# Altium project LimeSDR-QPCIe_1v2.PrjPcb (part 13 of 13)
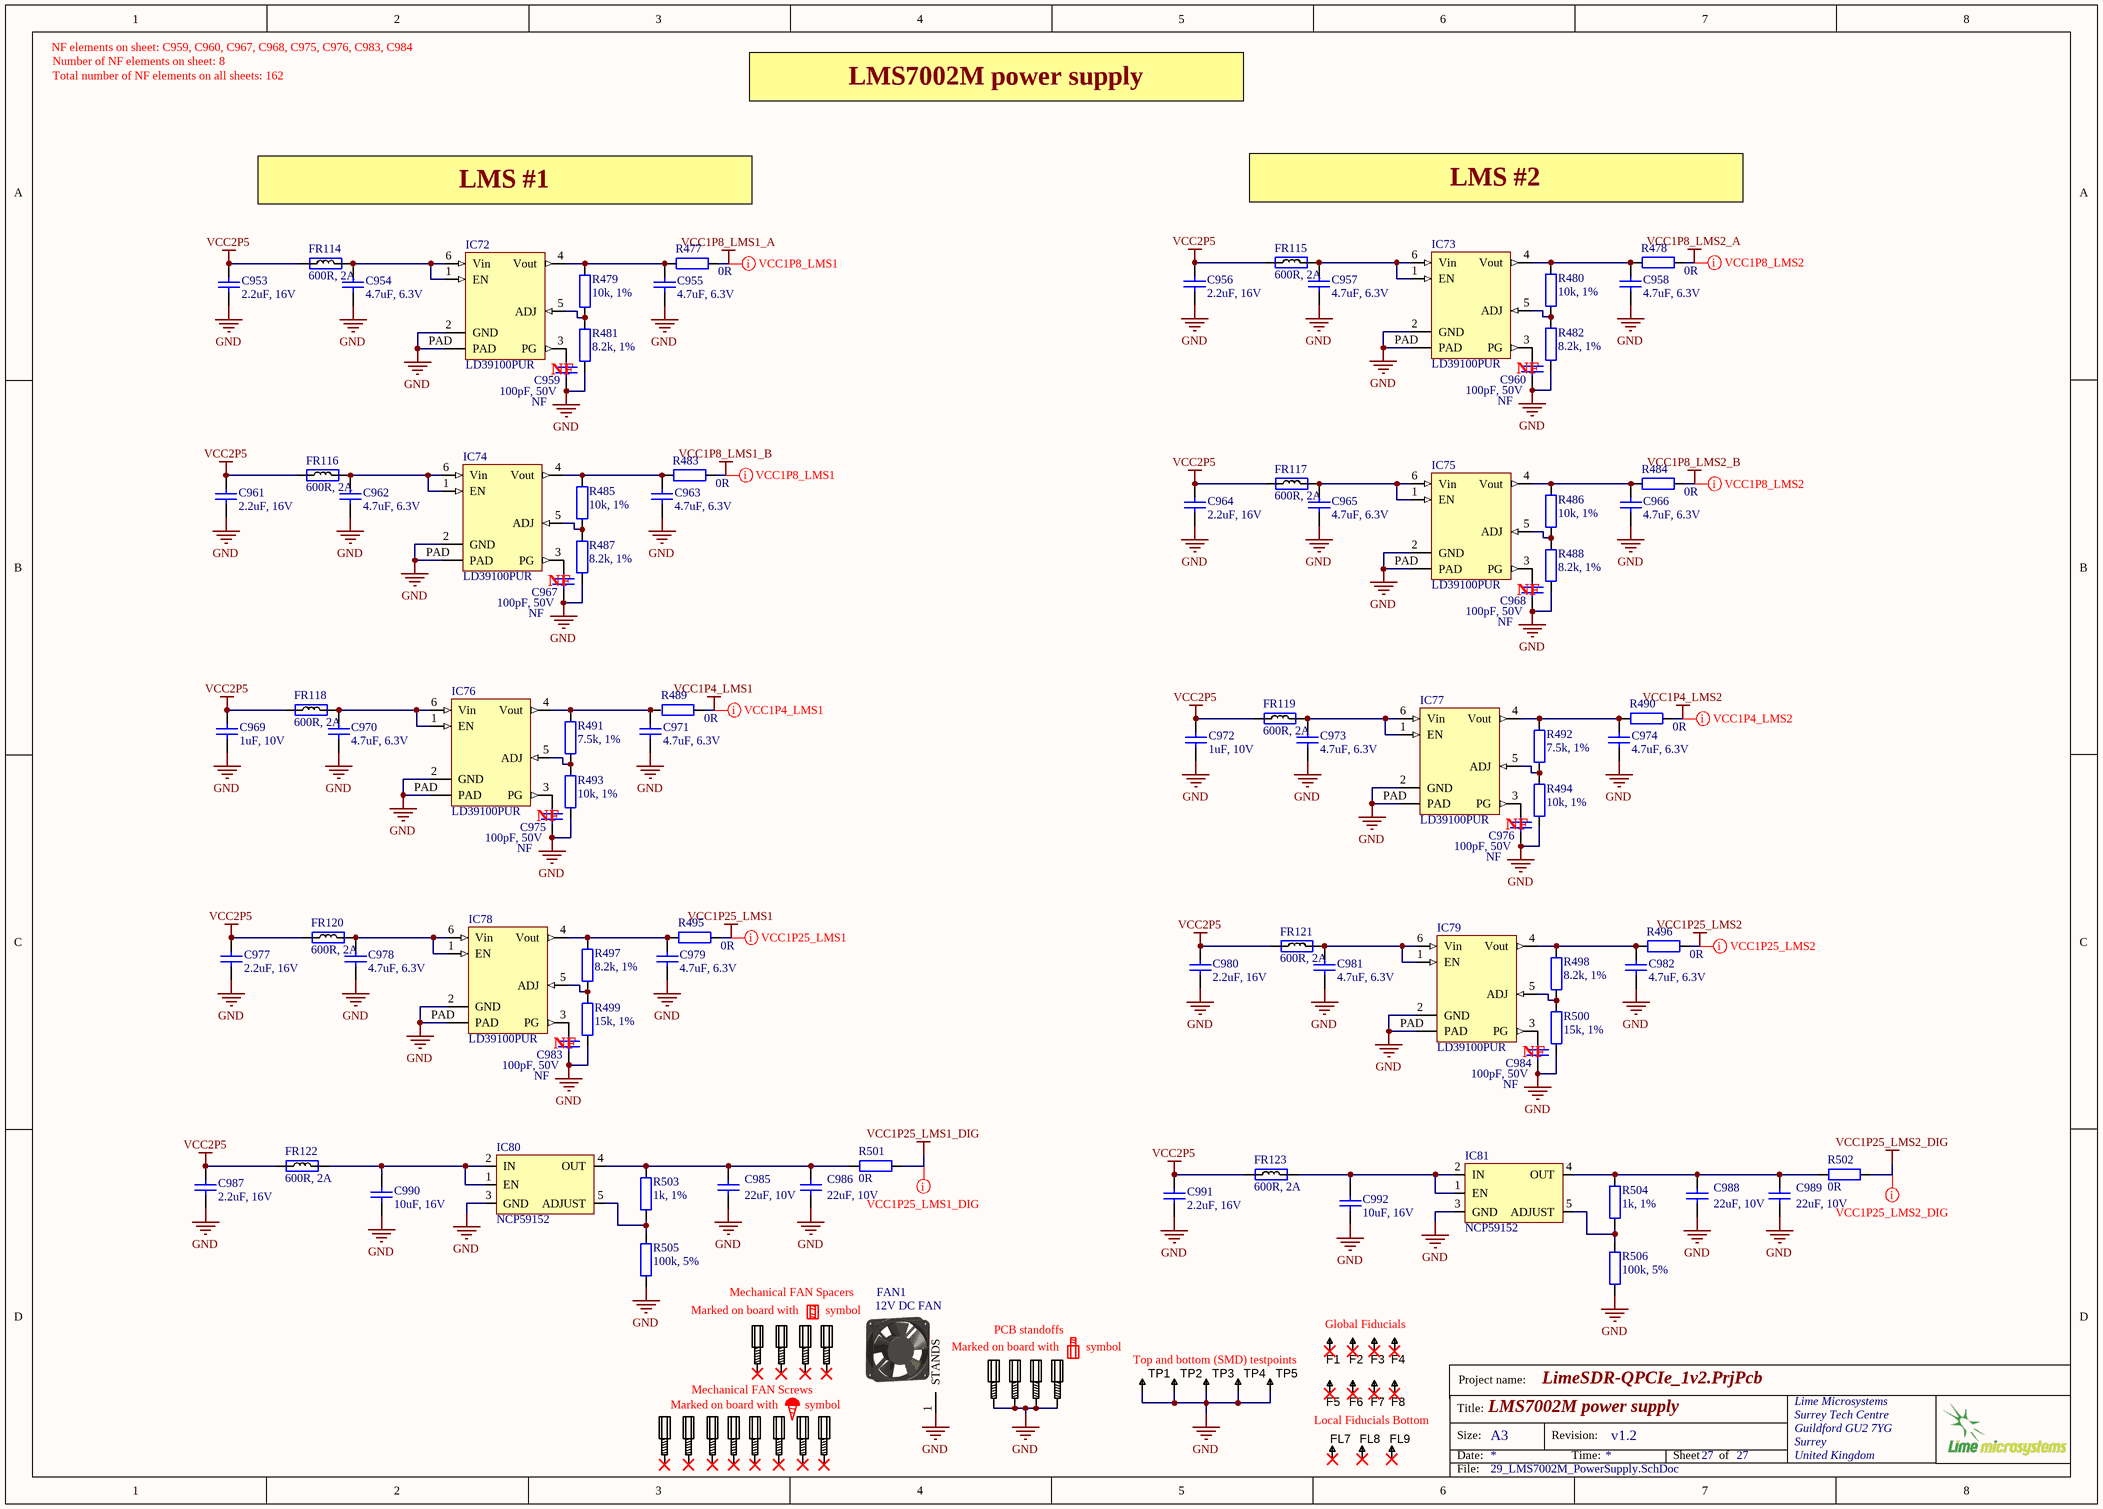
[diagram p29: 29_LMS7002M_PowerSupply.SchDoc]

## Nets that join several sheets
GND: 04_LMS7002M_Digital (8 pins), 05_LMS7002M_1_RF (42 pins), 06_LMS7002M_2_RF (42 pins), 07_LMS7002M_1_Power (93 pins), 08_LMS7002M_2_Power (93 pins), 09_RF_Loopback (98 pins), 10_RSSI1 (97 pins), 11_RSSI2 (92 pins), 12_FPGA_banks_3A_3B_4A (18 pins), 14_FPGA_banks_7A_8A (25 pins), 15_FPGA_misc_banks (25 pins), 16_FPGA_pwr_banks (243 pins), 17_FPGA_decoupling (146 pins), 18_DDR3_TOP (104 pins), 19_DDR3_BOT (104 pins), 20_ADC (52 pins), 21_DAC (40 pins), 22_USB3_0_device (77 pins), 23_PCIe (40 pins), 24_Peripherals (58 pins), 25_Clocks_1 (72 pins), 26_Clocks_2 (52 pins), 27_BoardPowerSupply 1 (120 pins), 28_BoardPowerSupply 2 (46 pins), 29_LMS7002M_PowerSupply (78 pins)
VCC1P1: 16_FPGA_pwr_banks (39 pins), 17_FPGA_decoupling (30 pins), 27_BoardPowerSupply 1 (5 pins)
VCC1P1E_FPGA: 16_FPGA_pwr_banks (15 pins), 17_FPGA_decoupling (8 pins)
VCC1P1L_FPGA: 16_FPGA_pwr_banks (11 pins), 17_FPGA_decoupling (C395.1 C396.1 C397.1 C398.1)
VCC1P2: 22_USB3_0_device (FR89.1 FR92.2 FR93.2 FR94.2), 28_BoardPowerSupply 2 (R468.1)
VCC1P4_LMS1: 07_LMS7002M_1_Power (6 pins), 29_LMS7002M_PowerSupply (R489.1)
VCC1P4_LMS2: 08_LMS7002M_2_Power (6 pins), 29_LMS7002M_PowerSupply (R490.1)
VCC1P5: 09_RF_Loopback (6 pins), 10_RSSI1 (7 pins), 11_RSSI2 (12 pins), 16_FPGA_pwr_banks (42 pins), 17_FPGA_decoupling (36 pins), 18_DDR3_TOP (81 pins), 19_DDR3_BOT (81 pins), 23_PCIe (R318.1 R319.1 VT14.G VT15.G), 24_Peripherals (20 pins), 27_BoardPowerSupply 1 (5 pins), 28_BoardPowerSupply 2 (6 pins)
VCC1P8: 10_RSSI1 (R111.1 R112.1 R113.1), 16_FPGA_pwr_banks (10 pins), 17_FPGA_decoupling (C399.1 C400.1 C401.1 C402.1), 20_ADC (FR81.1 FR82.1), 22_USB3_0_device (FR95.1), 25_Clocks_1 (R405.2), 26_Clocks_2 (C865.1 FR103.1 FR104.1 IC57.14), 28_BoardPowerSupply 2 (R460.1 R474.1)
VCC1P8_LMS1_A: 05_LMS7002M_1_RF (12 pins), 29_LMS7002M_PowerSupply (R477.1)
VCC1P8_LMS1_B: 05_LMS7002M_1_RF (12 pins), 07_LMS7002M_1_Power (11 pins), 25_Clocks_1 (R381.1), 29_LMS7002M_PowerSupply (R483.1)
VCC1P8_LMS2_A: 06_LMS7002M_2_RF (12 pins), 29_LMS7002M_PowerSupply (R478.1)
VCC1P8_LMS2_B: 06_LMS7002M_2_RF (12 pins), 08_LMS7002M_2_Power (11 pins), 25_Clocks_1 (R383.2), 29_LMS7002M_PowerSupply (R484.1)
VCC1P25_LMS1: 07_LMS7002M_1_Power (22 pins), 29_LMS7002M_PowerSupply (R495.1)
VCC1P25_LMS1_DIG: 07_LMS7002M_1_Power (R45.2 R47.2), 29_LMS7002M_PowerSupply (R501.1)
VCC1P25_LMS2: 08_LMS7002M_2_Power (22 pins), 29_LMS7002M_PowerSupply (R496.1)
VCC1P25_LMS2_DIG: 08_LMS7002M_2_Power (R63.2 R64.2), 29_LMS7002M_PowerSupply (R502.1)
VCC2P5: 15_FPGA_misc_banks (C318.1 J26.4 R162.1 R165.1), 16_FPGA_pwr_banks (22 pins), 17_FPGA_decoupling (15 pins), 25_Clocks_1 (R399.2 R408.2), 27_BoardPowerSupply 1 (7 pins), 28_BoardPowerSupply 2 (R473.2), 29_LMS7002M_PowerSupply (20 pins)
VCC2P5H_FPGA: 16_FPGA_pwr_banks (22 pins), 17_FPGA_decoupling (15 pins)
VCC3P0_BATT: 16_FPGA_pwr_banks (R191.1), 24_Peripherals (IC50.14 R360.2), 28_BoardPowerSupply 2 (BATT1.POSITIVE)
VCC3P3: 09_RF_Loopback (8 pins), 10_RSSI1 (7 pins), 11_RSSI2 (12 pins), 15_FPGA_misc_banks (18 pins), 16_FPGA_pwr_banks (IC29.AB24 IC29.AC11 IC29.F10), 17_FPGA_decoupling (C392.1 C393.1 C394.1), 20_ADC (R220.2), 21_DAC (FR83.1 FR84.1 FR85.1 FR86.1), 22_USB3_0_device (8 pins), 23_PCIe (R322.1), 24_Peripherals (27 pins), 26_Clocks_2 (FR105.1 FR108.1 FR109.1), 27_BoardPowerSupply 1 (8 pins), 28_BoardPowerSupply 2 (12 pins)
VCC3P3_CLK: 10_RSSI1 (FR74.1 R90.2 R103.2), 11_RSSI2 (R115.2 R128.2 R135.2 R148.2), 20_ADC (C673.1 C674.2 IC39.1), 22_USB3_0_device (FR91.2), 24_Peripherals (FR97.1), 25_Clocks_1 (9 pins), 26_Clocks_2 (10 pins), 28_BoardPowerSupply 2 (R455.1 R462.1)
VCC3P3_XO: 25_Clocks_1 (FR98.1 FR102.2), 28_BoardPowerSupply 2 (R462.2 R465.1 R469.1)
VCC5P0: 10_RSSI1 (FR71.1), 11_RSSI2 (FR75.1 FR76.1), 20_ADC (R223.2), 23_PCIe (R323.1), 24_Peripherals (R339.2), 27_BoardPowerSupply 1 (5 pins), 28_BoardPowerSupply 2 (FR112.1 FR113.1)
VCC12P0: 24_Peripherals (R338.2), 27_BoardPowerSupply 1 (51 pins)
VCC12P0_PCIE: 23_PCIe (10 pins), 27_BoardPowerSupply 1 (5 pins)
VDIO_DAC_FPGA: 16_FPGA_pwr_banks (19 pins), 17_FPGA_decoupling (13 pins), 26_Clocks_2 (C866.1 FR107.1 IC57.11), 27_BoardPowerSupply 1 (R420.1 R422.1), 28_BoardPowerSupply 2 (R461.1)
VDIO_LMS1: 04_LMS7002M_Digital (5 pins), 07_LMS7002M_1_Power (11 pins), 27_BoardPowerSupply 1 (C874.2 C875.1 FR110.2)
VDIO_LMS2: 04_LMS7002M_Digital (5 pins), 08_LMS7002M_2_Power (11 pins), 27_BoardPowerSupply 1 (C880.2 C881.1 FR111.2)
VDIO_LMS_FPGA: 16_FPGA_pwr_banks (20 pins), 17_FPGA_decoupling (14 pins), 27_BoardPowerSupply 1 (FR110.1 FR111.1 R419.1 R421.1)
VREF_DDR3_BOT: 16_FPGA_pwr_banks (IC29.AH16 IC29.AJ13), 17_FPGA_decoupling (C411.1 C412.1), 19_DDR3_BOT (6 pins), 28_BoardPowerSupply 2 (C933.1 IC65.6)
VREF_DDR3_TOP: 16_FPGA_pwr_banks (IC29.B9 IC29.B16), 17_FPGA_decoupling (C390.1 C391.1), 18_DDR3_TOP (6 pins), 28_BoardPowerSupply 2 (C940.1 IC67.6)
VTT_DDR3_BOT: 19_DDR3_BOT (36 pins), 28_BoardPowerSupply 2 (C931.2 C932.2 IC65.3 IC65.5)
VTT_DDR3_TOP: 18_DDR3_TOP (36 pins), 28_BoardPowerSupply 2 (C938.2 C939.2 IC67.3 IC67.5)
ADC_CLK: 13_FPGA_banks_5A_5B_6A (IC29.N30), 20_ADC (IC39.5)
ADC_CLKOUT_N: 14_FPGA_banks_7A_8A (IC29.L13), 20_ADC (IC37.56)
ADC_CLKOUT_P: 14_FPGA_banks_7A_8A (IC29.L14), 20_ADC (IC37.57)
ADC_DA0_N: 14_FPGA_banks_7A_8A (IC29.L9), 20_ADC (IC37.40)
ADC_DA0_P: 14_FPGA_banks_7A_8A (IC29.L10), 20_ADC (IC37.41)
ADC_DA1_N: 14_FPGA_banks_7A_8A (IC29.N11), 20_ADC (IC37.42)
ADC_DA1_P: 14_FPGA_banks_7A_8A (IC29.P10), 20_ADC (IC37.43)
ADC_DA2_N: 14_FPGA_banks_7A_8A (IC29.N9), 20_ADC (IC37.44)
ADC_DA2_P: 14_FPGA_banks_7A_8A (IC29.N10), 20_ADC (IC37.45)
ADC_DA3_N: 14_FPGA_banks_7A_8A (IC29.R11), 20_ADC (IC37.46)
ADC_DA3_P: 14_FPGA_banks_7A_8A (IC29.R12), 20_ADC (IC37.47)
ADC_DA4_N: 14_FPGA_banks_7A_8A (IC29.N12), 20_ADC (IC37.50)
ADC_DA4_P: 14_FPGA_banks_7A_8A (IC29.P12), 20_ADC (IC37.51)
ADC_DA5_N: 14_FPGA_banks_7A_8A (IC29.M11), 20_ADC (IC37.52)
ADC_DA5_P: 14_FPGA_banks_7A_8A (IC29.M12), 20_ADC (IC37.53)
ADC_DA6_N: 14_FPGA_banks_7A_8A (IC29.K11), 20_ADC (IC37.54)
ADC_DA6_P: 14_FPGA_banks_7A_8A (IC29.L11), 20_ADC (IC37.55)
ADC_DB0_N: 14_FPGA_banks_7A_8A (IC29.J12), 20_ADC (IC37.60)
ADC_DB0_P: 14_FPGA_banks_7A_8A (IC29.K12), 20_ADC (IC37.61)
ADC_DB1_N: 14_FPGA_banks_7A_8A (IC29.E21), 20_ADC (IC37.62)
ADC_DB1_P: 14_FPGA_banks_7A_8A (IC29.E22), 20_ADC (IC37.63)
ADC_DB2_N: 14_FPGA_banks_7A_8A (IC29.D10), 20_ADC (IC37.2)
ADC_DB2_P: 14_FPGA_banks_7A_8A (IC29.E11), 20_ADC (IC37.3)
ADC_DB3_N: 14_FPGA_banks_7A_8A (IC29.F14), 20_ADC (IC37.4)
ADC_DB3_P: 14_FPGA_banks_7A_8A (IC29.G14), 20_ADC (IC37.5)
ADC_DB4_N: 14_FPGA_banks_7A_8A (IC29.G12), 20_ADC (IC37.6)
ADC_DB4_P: 14_FPGA_banks_7A_8A (IC29.H12), 20_ADC (IC37.7)
ADC_DB5_N: 14_FPGA_banks_7A_8A (IC29.H14), 20_ADC (IC37.8)
ADC_DB5_P: 14_FPGA_banks_7A_8A (IC29.J14), 20_ADC (IC37.9)
ADC_DB6_N: 14_FPGA_banks_7A_8A (IC29.J13), 20_ADC (IC37.10)
ADC_DB6_P: 14_FPGA_banks_7A_8A (IC29.K13), 20_ADC (IC37.11)
ADF_MUXOUT: 14_FPGA_banks_7A_8A (IC29.G7), 25_Clocks_1 (R392.1 R396.1)
CLK100_FPGA: 12_FPGA_banks_3A_3B_4A (IC29.Y15), 26_Clocks_2 (XO5.3)
CLK125_FPGA: 14_FPGA_banks_7A_8A (IC29.L15), 26_Clocks_2 (XO6.3)
CLK125_FPGA_BOT_N: 12_FPGA_banks_3A_3B_4A (IC29.AC14), 26_Clocks_2 (XO8.5)
CLK125_FPGA_BOT_P: 12_FPGA_banks_3A_3B_4A (IC29.AB14), 26_Clocks_2 (XO8.4)
CLK125_FPGA_REF_N: 15_FPGA_misc_banks (C326.2), 26_Clocks_2 (XO9.5)
CLK125_FPGA_REF_P: 15_FPGA_misc_banks (C325.2), 26_Clocks_2 (XO9.4)
CLK125_FPGA_TOP_N: 14_FPGA_banks_7A_8A (IC29.J18), 26_Clocks_2 (XO7.5)
CLK125_FPGA_TOP_P: 14_FPGA_banks_7A_8A (IC29.H19), 26_Clocks_2 (XO7.4)
CLK_LMK_FPGA_IN: 12_FPGA_banks_3A_3B_4A (IC29.AB17), 25_Clocks_1 (IC52.8)
CLK_LMK_FPGA_OUT: 13_FPGA_banks_5A_5B_6A (IC29.N21), 25_Clocks_1 (R368.1)
DAC1_CLK: 21_DAC (5 pins), 26_Clocks_2 (IC55.3)
DAC1_DA0: 13_FPGA_banks_5A_5B_6A (IC29.E27), 21_DAC (IC40.14)
DAC1_DA1: 13_FPGA_banks_5A_5B_6A (IC29.F25), 21_DAC (IC40.13)
DAC1_DA2: 13_FPGA_banks_5A_5B_6A (IC29.D28), 21_DAC (IC40.12)
DAC1_DA3: 13_FPGA_banks_5A_5B_6A (IC29.E28), 21_DAC (IC40.11)
DAC1_DA4: 13_FPGA_banks_5A_5B_6A (IC29.F26), 21_DAC (IC40.10)
DAC1_DA5: 13_FPGA_banks_5A_5B_6A (IC29.E30), 21_DAC (IC40.9)
DAC1_DA6: 13_FPGA_banks_5A_5B_6A (IC29.D27), 21_DAC (IC40.8)
DAC1_DA7: 13_FPGA_banks_5A_5B_6A (IC29.C29), 21_DAC (IC40.7)
DAC1_DA8: 13_FPGA_banks_5A_5B_6A (IC29.C30), 21_DAC (IC40.6)
DAC1_DA9: 13_FPGA_banks_5A_5B_6A (IC29.D29), 21_DAC (IC40.5)
DAC1_DA10: 13_FPGA_banks_5A_5B_6A (IC29.D30), 21_DAC (IC40.4)
DAC1_DA11: 13_FPGA_banks_5A_5B_6A (IC29.B29), 21_DAC (IC40.3)
DAC1_DA12: 13_FPGA_banks_5A_5B_6A (IC29.A29), 21_DAC (IC40.2)
DAC1_DA13: 13_FPGA_banks_5A_5B_6A (IC29.B28), 21_DAC (IC40.1)
DAC1_DB0: 13_FPGA_banks_5A_5B_6A (IC29.F28), 21_DAC (IC40.36)
DAC1_DB1: 13_FPGA_banks_5A_5B_6A (IC29.F30), 21_DAC (IC40.35)
DAC1_DB2: 13_FPGA_banks_5A_5B_6A (IC29.J28), 21_DAC (IC40.34)
DAC1_DB3: 13_FPGA_banks_5A_5B_6A (IC29.F29), 21_DAC (IC40.33)
DAC1_DB4: 13_FPGA_banks_5A_5B_6A (IC29.K30), 21_DAC (IC40.32)
DAC1_DB5: 13_FPGA_banks_5A_5B_6A (IC29.K28), 21_DAC (IC40.31)
DAC1_DB6: 13_FPGA_banks_5A_5B_6A (IC29.G29), 21_DAC (IC40.30)
DAC1_DB7: 13_FPGA_banks_5A_5B_6A (IC29.J29), 21_DAC (IC40.29)
DAC1_DB8: 13_FPGA_banks_5A_5B_6A (IC29.J30), 21_DAC (IC40.28)
DAC1_DB9: 13_FPGA_banks_5A_5B_6A (IC29.H27), 21_DAC (IC40.27)
DAC1_DB10: 13_FPGA_banks_5A_5B_6A (IC29.H29), 21_DAC (IC40.26)
DAC1_DB11: 13_FPGA_banks_5A_5B_6A (IC29.H30), 21_DAC (IC40.25)
DAC1_DB12: 13_FPGA_banks_5A_5B_6A (IC29.H26), 21_DAC (IC40.24)
DAC1_DB13: 13_FPGA_banks_5A_5B_6A (IC29.H25), 21_DAC (IC40.23)
DAC1_MODE: 13_FPGA_banks_5A_5B_6A (IC29.J23), 21_DAC (IC40.48)
DAC1_SLEEP: 13_FPGA_banks_5A_5B_6A (IC29.J25), 21_DAC (IC40.37)
DAC2_CLK: 21_DAC (5 pins), 26_Clocks_2 (IC55.5)
DAC2_DA0: 13_FPGA_banks_5A_5B_6A (IC29.R27), 21_DAC (IC41.14)
DAC2_DA1: 13_FPGA_banks_5A_5B_6A (IC29.K26), 21_DAC (IC41.13)
DAC2_DA2: 13_FPGA_banks_5A_5B_6A (IC29.N27), 21_DAC (IC41.12)
DAC2_DA3: 13_FPGA_banks_5A_5B_6A (IC29.P30), 21_DAC (IC41.11)
DAC2_DA4: 13_FPGA_banks_5A_5B_6A (IC29.N29), 21_DAC (IC41.10)
DAC2_DA5: 13_FPGA_banks_5A_5B_6A (IC29.M27), 21_DAC (IC41.9)
DAC2_DA6: 13_FPGA_banks_5A_5B_6A (IC29.M28), 21_DAC (IC41.8)
DAC2_DA7: 13_FPGA_banks_5A_5B_6A (IC29.L26), 21_DAC (IC41.7)
DAC2_DA8: 13_FPGA_banks_5A_5B_6A (IC29.L28), 21_DAC (IC41.6)
DAC2_DA9: 13_FPGA_banks_5A_5B_6A (IC29.L29), 21_DAC (IC41.5)
DAC2_DA10: 13_FPGA_banks_5A_5B_6A (IC29.L25), 21_DAC (IC41.4)
DAC2_DA11: 13_FPGA_banks_5A_5B_6A (IC29.L30), 21_DAC (IC41.3)
DAC2_DA12: 13_FPGA_banks_5A_5B_6A (IC29.P29), 21_DAC (IC41.2)
DAC2_DA13: 13_FPGA_banks_5A_5B_6A (IC29.N26), 21_DAC (IC41.1)
DAC2_DB0: 13_FPGA_banks_5A_5B_6A (IC29.P28), 21_DAC (IC41.36)
DAC2_DB1: 13_FPGA_banks_5A_5B_6A (IC29.N25), 21_DAC (IC41.35)
DAC2_DB2: 13_FPGA_banks_5A_5B_6A (IC29.P25), 21_DAC (IC41.34)
DAC2_DB3: 13_FPGA_banks_5A_5B_6A (IC29.R28), 21_DAC (IC41.33)
DAC2_DB4: 13_FPGA_banks_5A_5B_6A (IC29.R25), 21_DAC (IC41.32)
DAC2_DB5: 13_FPGA_banks_5A_5B_6A (IC29.K27), 21_DAC (IC41.31)
DAC2_DB6: 13_FPGA_banks_5A_5B_6A (IC29.N24), 21_DAC (IC41.30)
DAC2_DB7: 13_FPGA_banks_5A_5B_6A (IC29.M23), 21_DAC (IC41.29)
DAC2_DB8: 13_FPGA_banks_5A_5B_6A (IC29.M22), 21_DAC (IC41.28)
DAC2_DB9: 13_FPGA_banks_5A_5B_6A (IC29.N22), 21_DAC (IC41.27)
DAC2_DB10: 13_FPGA_banks_5A_5B_6A (IC29.R20), 21_DAC (IC41.26)
DAC2_DB11: 13_FPGA_banks_5A_5B_6A (IC29.T21), 21_DAC (IC41.25)
DAC2_DB12: 13_FPGA_banks_5A_5B_6A (IC29.R21), 21_DAC (IC41.24)
DAC2_DB13: 13_FPGA_banks_5A_5B_6A (IC29.R22), 21_DAC (IC41.23)
DAC2_MODE: 13_FPGA_banks_5A_5B_6A (IC29.L23), 21_DAC (IC41.48)
DAC2_SLEEP: 13_FPGA_banks_5A_5B_6A (IC29.L24), 21_DAC (IC41.37)
DAC_CLK_WRT: 13_FPGA_banks_5A_5B_6A (IC29.M29), 26_Clocks_2 (C835.2)
DDR3_BOT_A0: 12_FPGA_banks_3A_3B_4A (IC29.AJ12), 19_DDR3_BOT (IC35.N3 IC36.N3 R200.6)
DDR3_BOT_A1: 12_FPGA_banks_3A_3B_4A (IC29.AK12), 19_DDR3_BOT (IC35.P7 IC36.P7 R203.4)
DDR3_BOT_A2: 12_FPGA_banks_3A_3B_4A (IC29.AH11), 19_DDR3_BOT (IC35.P3 IC36.P3 R200.4)
DDR3_BOT_A3: 12_FPGA_banks_3A_3B_4A (IC29.AH12), 19_DDR3_BOT (IC35.N2 IC36.N2 R200.5)
DDR3_BOT_A4: 12_FPGA_banks_3A_3B_4A (IC29.AG13), 19_DDR3_BOT (IC35.P8 IC36.P8 R203.3)
DDR3_BOT_A5: 12_FPGA_banks_3A_3B_4A (IC29.AG14), 19_DDR3_BOT (IC35.P2 IC36.P2 R200.3)
DDR3_BOT_A6: 12_FPGA_banks_3A_3B_4A (IC29.AK10), 19_DDR3_BOT (IC35.R8 IC36.R8 R203.5)
DDR3_BOT_A7: 12_FPGA_banks_3A_3B_4A (IC29.AK11), 19_DDR3_BOT (IC35.R2 IC36.R2 R200.1)
DDR3_BOT_A8: 12_FPGA_banks_3A_3B_4A (IC29.AF11), 19_DDR3_BOT (IC35.T8 IC36.T8 R203.7)
DDR3_BOT_A9: 12_FPGA_banks_3A_3B_4A (IC29.AG11), 19_DDR3_BOT (IC35.R3 IC36.R3 R200.2)
DDR3_BOT_A10: 12_FPGA_banks_3A_3B_4A (IC29.AJ8), 19_DDR3_BOT (IC35.L7 IC36.L7 R203.1)
DDR3_BOT_A11: 12_FPGA_banks_3A_3B_4A (IC29.AK8), 19_DDR3_BOT (IC35.R7 IC36.R7 R203.6)
DDR3_BOT_A12: 12_FPGA_banks_3A_3B_4A (IC29.AJ7), 19_DDR3_BOT (IC35.N7 IC36.N7 R203.2)
DDR3_BOT_A13: 12_FPGA_banks_3A_3B_4A (IC29.AK7), 19_DDR3_BOT (IC35.T3 IC36.T3 R203.8)
DDR3_BOT_BA0: 12_FPGA_banks_3A_3B_4A (IC29.AH9), 19_DDR3_BOT (IC35.M2 IC36.M2 R200.8)
DDR3_BOT_BA1: 12_FPGA_banks_3A_3B_4A (IC29.AH10), 19_DDR3_BOT (IC35.N8 IC36.N8 R205.5)
DDR3_BOT_BA2: 12_FPGA_banks_3A_3B_4A (IC29.AJ10), 19_DDR3_BOT (IC35.M3 IC36.M3 R205.8)
DDR3_BOT_CASn: 12_FPGA_banks_3A_3B_4A (IC29.AF9), 19_DDR3_BOT (IC35.K3 IC36.K3 R205.4)
DDR3_BOT_CK_N: 12_FPGA_banks_3A_3B_4A (IC29.AA14), 19_DDR3_BOT (IC35.K7 IC36.K7 R202.2 R207.2)
DDR3_BOT_CK_P: 12_FPGA_banks_3A_3B_4A (IC29.Y13), 19_DDR3_BOT (IC35.J7 IC36.J7 R202.1 R207.1)
DDR3_BOT_CKE: 12_FPGA_banks_3A_3B_4A (IC29.AK18), 19_DDR3_BOT (IC35.K9 IC36.K9 R204.1)
DDR3_BOT_CSn: 12_FPGA_banks_3A_3B_4A (IC29.Y12), 19_DDR3_BOT (IC35.L2 IC36.L2 R205.7)
DDR3_BOT_DM0: 12_FPGA_banks_3A_3B_4A (IC29.AE15), 19_DDR3_BOT (IC35.E7)
DDR3_BOT_DM1: 12_FPGA_banks_3A_3B_4A (IC29.AH19), 19_DDR3_BOT (IC35.D3)
DDR3_BOT_DM2: 12_FPGA_banks_3A_3B_4A (IC29.AJ23), 19_DDR3_BOT (IC36.E7)
DDR3_BOT_DM3: 12_FPGA_banks_3A_3B_4A (IC29.AJ27), 19_DDR3_BOT (IC36.D3)
DDR3_BOT_DQ0: 12_FPGA_banks_3A_3B_4A (IC29.AF15), 19_DDR3_BOT (IC35.E3)
DDR3_BOT_DQ1: 12_FPGA_banks_3A_3B_4A (IC29.AE16), 19_DDR3_BOT (IC35.F7)
DDR3_BOT_DQ2: 12_FPGA_banks_3A_3B_4A (IC29.AJ14), 19_DDR3_BOT (IC35.F2)
DDR3_BOT_DQ3: 12_FPGA_banks_3A_3B_4A (IC29.AH15), 19_DDR3_BOT (IC35.F8)
DDR3_BOT_DQ4: 12_FPGA_banks_3A_3B_4A (IC29.AE17), 19_DDR3_BOT (IC35.H3)
DDR3_BOT_DQ5: 12_FPGA_banks_3A_3B_4A (IC29.AD17), 19_DDR3_BOT (IC35.H8)
DDR3_BOT_DQ6: 12_FPGA_banks_3A_3B_4A (IC29.AJ15), 19_DDR3_BOT (IC35.G2)
DDR3_BOT_DQ7: 12_FPGA_banks_3A_3B_4A (IC29.AF14), 19_DDR3_BOT (IC35.H7)
DDR3_BOT_DQ8: 12_FPGA_banks_3A_3B_4A (IC29.AK17), 19_DDR3_BOT (IC35.D7)
DDR3_BOT_DQ9: 12_FPGA_banks_3A_3B_4A (IC29.AK16), 19_DDR3_BOT (IC35.C3)
DDR3_BOT_DQ10: 12_FPGA_banks_3A_3B_4A (IC29.AG17), 19_DDR3_BOT (IC35.C8)
DDR3_BOT_DQ11: 12_FPGA_banks_3A_3B_4A (IC29.AJ18), 19_DDR3_BOT (IC35.C2)
DDR3_BOT_DQ12: 12_FPGA_banks_3A_3B_4A (IC29.AG16), 19_DDR3_BOT (IC35.A7)
DDR3_BOT_DQ13: 12_FPGA_banks_3A_3B_4A (IC29.AF16), 19_DDR3_BOT (IC35.A2)
DDR3_BOT_DQ14: 12_FPGA_banks_3A_3B_4A (IC29.AJ19), 19_DDR3_BOT (IC35.B8)
DDR3_BOT_DQ15: 12_FPGA_banks_3A_3B_4A (IC29.AH20), 19_DDR3_BOT (IC35.A3)
DDR3_BOT_DQ16: 12_FPGA_banks_3A_3B_4A (IC29.AE18), 19_DDR3_BOT (IC36.E3)
DDR3_BOT_DQ17: 12_FPGA_banks_3A_3B_4A (IC29.AD18), 19_DDR3_BOT (IC36.F7)
DDR3_BOT_DQ18: 12_FPGA_banks_3A_3B_4A (IC29.AJ20), 19_DDR3_BOT (IC36.F2)
DDR3_BOT_DQ19: 12_FPGA_banks_3A_3B_4A (IC29.AK22), 19_DDR3_BOT (IC36.F8)
DDR3_BOT_DQ20: 12_FPGA_banks_3A_3B_4A (IC29.AF19), 19_DDR3_BOT (IC36.H3)
DDR3_BOT_DQ21: 12_FPGA_banks_3A_3B_4A (IC29.AF18), 19_DDR3_BOT (IC36.H8)
DDR3_BOT_DQ22: 12_FPGA_banks_3A_3B_4A (IC29.AH21), 19_DDR3_BOT (IC36.G2)
DDR3_BOT_DQ23: 12_FPGA_banks_3A_3B_4A (IC29.AK23), 19_DDR3_BOT (IC36.H7)
DDR3_BOT_DQ24: 12_FPGA_banks_3A_3B_4A (IC29.AG19), 19_DDR3_BOT (IC36.D7)
DDR3_BOT_DQ25: 12_FPGA_banks_3A_3B_4A (IC29.AG18), 19_DDR3_BOT (IC36.C3)
DDR3_BOT_DQ26: 12_FPGA_banks_3A_3B_4A (IC29.AH24), 19_DDR3_BOT (IC36.C8)
DDR3_BOT_DQ27: 12_FPGA_banks_3A_3B_4A (IC29.AK25), 19_DDR3_BOT (IC36.C2)
DDR3_BOT_DQ28: 12_FPGA_banks_3A_3B_4A (IC29.AE20), 19_DDR3_BOT (IC36.A7)
DDR3_BOT_DQ29: 12_FPGA_banks_3A_3B_4A (IC29.AD19), 19_DDR3_BOT (IC36.A2)
DDR3_BOT_DQ30: 12_FPGA_banks_3A_3B_4A (IC29.AG24), 19_DDR3_BOT (IC36.B8)
DDR3_BOT_DQ31: 12_FPGA_banks_3A_3B_4A (IC29.AK26), 19_DDR3_BOT (IC36.A3)
DDR3_BOT_DQS0_N: 12_FPGA_banks_3A_3B_4A (IC29.AA16), 19_DDR3_BOT (IC35.G3)
DDR3_BOT_DQS0_P: 12_FPGA_banks_3A_3B_4A (IC29.Y16), 19_DDR3_BOT (IC35.F3)
DDR3_BOT_DQS1_N: 12_FPGA_banks_3A_3B_4A (IC29.Y18), 19_DDR3_BOT (IC35.B7)
DDR3_BOT_DQS1_P: 12_FPGA_banks_3A_3B_4A (IC29.Y17), 19_DDR3_BOT (IC35.C7)
DDR3_BOT_DQS2_N: 12_FPGA_banks_3A_3B_4A (IC29.AA20), 19_DDR3_BOT (IC36.G3)
DDR3_BOT_DQS2_P: 12_FPGA_banks_3A_3B_4A (IC29.Y20), 19_DDR3_BOT (IC36.F3)
DDR3_BOT_DQS3_N: 12_FPGA_banks_3A_3B_4A (IC29.AC19), 19_DDR3_BOT (IC36.B7)
DDR3_BOT_DQS3_P: 12_FPGA_banks_3A_3B_4A (IC29.AB19), 19_DDR3_BOT (IC36.C7)
DDR3_BOT_ODT: 12_FPGA_banks_3A_3B_4A (IC29.AH14), 19_DDR3_BOT (IC35.K1 IC36.K1 R205.2)
DDR3_BOT_RASn: 12_FPGA_banks_3A_3B_4A (IC29.AG9), 19_DDR3_BOT (IC35.J3 IC36.J3 R205.6)
DDR3_BOT_RESETn: 12_FPGA_banks_3A_3B_4A (IC29.AK21), 19_DDR3_BOT (IC35.T2 IC36.T2 R205.3)
DDR3_BOT_WEn: 12_FPGA_banks_3A_3B_4A (IC29.AK5), 19_DDR3_BOT (IC35.L3 IC36.L3 R205.1)
DDR3_TOP_A0: 14_FPGA_banks_7A_8A (IC29.B11), 18_DDR3_TOP (IC33.N3 IC34.N3 R192.6)
DDR3_TOP_A1: 14_FPGA_banks_7A_8A (IC29.A11), 18_DDR3_TOP (IC33.P7 IC34.P7 R195.4)
DDR3_TOP_A2: 14_FPGA_banks_7A_8A (IC29.F9), 18_DDR3_TOP (IC33.P3 IC34.P3 R192.4)
DDR3_TOP_A3: 14_FPGA_banks_7A_8A (IC29.E10), 18_DDR3_TOP (IC33.N2 IC34.N2 R192.5)
DDR3_TOP_A4: 14_FPGA_banks_7A_8A (IC29.F16), 18_DDR3_TOP (IC33.P8 IC34.P8 R195.3)
DDR3_TOP_A5: 14_FPGA_banks_7A_8A (IC29.E16), 18_DDR3_TOP (IC33.P2 IC34.P2 R192.3)
DDR3_TOP_A6: 14_FPGA_banks_7A_8A (IC29.D9), 18_DDR3_TOP (IC33.R8 IC34.R8 R195.5)
DDR3_TOP_A7: 14_FPGA_banks_7A_8A (IC29.C10), 18_DDR3_TOP (IC33.R2 IC34.R2 R192.1)
DDR3_TOP_A8: 14_FPGA_banks_7A_8A (IC29.E12), 18_DDR3_TOP (IC33.T8 IC34.T8 R195.7)
DDR3_TOP_A9: 14_FPGA_banks_7A_8A (IC29.D13), 18_DDR3_TOP (IC33.R3 IC34.R3 R192.2)
DDR3_TOP_A10: 14_FPGA_banks_7A_8A (IC29.B7), 18_DDR3_TOP (IC33.L7 IC34.L7 R195.1)
DDR3_TOP_A11: 14_FPGA_banks_7A_8A (IC29.A8), 18_DDR3_TOP (IC33.R7 IC34.R7 R195.6)
DDR3_TOP_A12: 14_FPGA_banks_7A_8A (IC29.B6), 18_DDR3_TOP (IC33.N7 IC34.N7 R195.2)
DDR3_TOP_A13: 14_FPGA_banks_7A_8A (IC29.A6), 18_DDR3_TOP (IC33.T3 IC34.T3 R195.8)
DDR3_TOP_BA0: 14_FPGA_banks_7A_8A (IC29.A10), 18_DDR3_TOP (IC33.M2 IC34.M2 R192.8)
DDR3_TOP_BA1: 14_FPGA_banks_7A_8A (IC29.F15), 18_DDR3_TOP (IC33.N8 IC34.N8 R197.5)
DDR3_TOP_BA2: 14_FPGA_banks_7A_8A (IC29.E15), 18_DDR3_TOP (IC33.M3 IC34.M3 R197.8)
DDR3_TOP_CASn: 14_FPGA_banks_7A_8A (IC29.C9), 18_DDR3_TOP (IC33.K3 IC34.K3 R197.4)
DDR3_TOP_CK_N: 14_FPGA_banks_7A_8A (IC29.M8), 18_DDR3_TOP (IC33.K7 IC34.K7 R194.2 R199.2)
DDR3_TOP_CK_P: 14_FPGA_banks_7A_8A (IC29.M9), 18_DDR3_TOP (IC33.J7 IC34.J7 R194.1 R199.1)
DDR3_TOP_CKE: 14_FPGA_banks_7A_8A (IC29.A18), 18_DDR3_TOP (IC33.K9 IC34.K9 R196.1)
DDR3_TOP_CSn: 14_FPGA_banks_7A_8A (IC29.J15), 18_DDR3_TOP (IC33.L2 IC34.L2 R197.7)
DDR3_TOP_DM0: 14_FPGA_banks_7A_8A (IC29.B14), 18_DDR3_TOP (IC33.E7)
DDR3_TOP_DM1: 14_FPGA_banks_7A_8A (IC29.B19), 18_DDR3_TOP (IC33.D3)
DDR3_TOP_DM2: 14_FPGA_banks_7A_8A (IC29.C24), 18_DDR3_TOP (IC34.E7)
DDR3_TOP_DM3: 14_FPGA_banks_7A_8A (IC29.D25), 18_DDR3_TOP (IC34.D3)
DDR3_TOP_DQ0: 14_FPGA_banks_7A_8A (IC29.C15), 18_DDR3_TOP (IC33.E3)
DDR3_TOP_DQ1: 14_FPGA_banks_7A_8A (IC29.C16), 18_DDR3_TOP (IC33.F7)
DDR3_TOP_DQ2: 14_FPGA_banks_7A_8A (IC29.C11), 18_DDR3_TOP (IC33.F2)
DDR3_TOP_DQ3: 14_FPGA_banks_7A_8A (IC29.A13), 18_DDR3_TOP (IC33.F8)
DDR3_TOP_DQ4: 14_FPGA_banks_7A_8A (IC29.D17), 18_DDR3_TOP (IC33.H3)
DDR3_TOP_DQ5: 14_FPGA_banks_7A_8A (IC29.E17), 18_DDR3_TOP (IC33.H8)
DDR3_TOP_DQ6: 14_FPGA_banks_7A_8A (IC29.D12), 18_DDR3_TOP (IC33.G2)
DDR3_TOP_DQ7: 14_FPGA_banks_7A_8A (IC29.A14), 18_DDR3_TOP (IC33.H7)
DDR3_TOP_DQ8: 14_FPGA_banks_7A_8A (IC29.B17), 18_DDR3_TOP (IC33.D7)
DDR3_TOP_DQ9: 14_FPGA_banks_7A_8A (IC29.C17), 18_DDR3_TOP (IC33.C3)
DDR3_TOP_DQ10: 14_FPGA_banks_7A_8A (IC29.A16), 18_DDR3_TOP (IC33.C8)
DDR3_TOP_DQ11: 14_FPGA_banks_7A_8A (IC29.C14), 18_DDR3_TOP (IC33.C2)
DDR3_TOP_DQ12: 14_FPGA_banks_7A_8A (IC29.F18), 18_DDR3_TOP (IC33.A7)
DDR3_TOP_DQ13: 14_FPGA_banks_7A_8A (IC29.G18), 18_DDR3_TOP (IC33.A2)
DDR3_TOP_DQ14: 14_FPGA_banks_7A_8A (IC29.B18), 18_DDR3_TOP (IC33.B8)
DDR3_TOP_DQ15: 14_FPGA_banks_7A_8A (IC29.A19), 18_DDR3_TOP (IC33.A3)
DDR3_TOP_DQ16: 14_FPGA_banks_7A_8A (IC29.D18), 18_DDR3_TOP (IC34.E3)
DDR3_TOP_DQ17: 14_FPGA_banks_7A_8A (IC29.D19), 18_DDR3_TOP (IC34.F7)
DDR3_TOP_DQ18: 14_FPGA_banks_7A_8A (IC29.A21), 18_DDR3_TOP (IC34.F2)
DDR3_TOP_DQ19: 14_FPGA_banks_7A_8A (IC29.B21), 18_DDR3_TOP (IC34.F8)
DDR3_TOP_DQ20: 14_FPGA_banks_7A_8A (IC29.E18), 18_DDR3_TOP (IC34.H3)
DDR3_TOP_DQ21: 14_FPGA_banks_7A_8A (IC29.F19), 18_DDR3_TOP (IC34.H8)
DDR3_TOP_DQ22: 14_FPGA_banks_7A_8A (IC29.B23), 18_DDR3_TOP (IC34.G2)
DDR3_TOP_DQ23: 14_FPGA_banks_7A_8A (IC29.B24), 18_DDR3_TOP (IC34.H7)
DDR3_TOP_DQ24: 14_FPGA_banks_7A_8A (IC29.C19), 18_DDR3_TOP (IC34.D7)
DDR3_TOP_DQ25: 14_FPGA_banks_7A_8A (IC29.D20), 18_DDR3_TOP (IC34.C3)
DDR3_TOP_DQ26: 14_FPGA_banks_7A_8A (IC29.A25), 18_DDR3_TOP (IC34.C8)
DDR3_TOP_DQ27: 14_FPGA_banks_7A_8A (IC29.D22), 18_DDR3_TOP (IC34.C2)
DDR3_TOP_DQ28: 14_FPGA_banks_7A_8A (IC29.C20), 18_DDR3_TOP (IC34.A7)
DDR3_TOP_DQ29: 14_FPGA_banks_7A_8A (IC29.C21), 18_DDR3_TOP (IC34.A2)
DDR3_TOP_DQ30: 14_FPGA_banks_7A_8A (IC29.D23), 18_DDR3_TOP (IC34.B8)
DDR3_TOP_DQ31: 14_FPGA_banks_7A_8A (IC29.C25), 18_DDR3_TOP (IC34.A3)
DDR3_TOP_DQS0_N: 14_FPGA_banks_7A_8A (IC29.J17), 18_DDR3_TOP (IC33.G3)
DDR3_TOP_DQS0_P: 14_FPGA_banks_7A_8A (IC29.K17), 18_DDR3_TOP (IC33.F3)
DDR3_TOP_DQS1_N: 14_FPGA_banks_7A_8A (IC29.L16), 18_DDR3_TOP (IC33.B7)
DDR3_TOP_DQS1_P: 14_FPGA_banks_7A_8A (IC29.K16), 18_DDR3_TOP (IC33.C7)
DDR3_TOP_DQS2_N: 14_FPGA_banks_7A_8A (IC29.K18), 18_DDR3_TOP (IC34.G3)
DDR3_TOP_DQS2_P: 14_FPGA_banks_7A_8A (IC29.L18), 18_DDR3_TOP (IC34.F3)
DDR3_TOP_DQS3_N: 14_FPGA_banks_7A_8A (IC29.J19), 18_DDR3_TOP (IC34.B7)
DDR3_TOP_DQS3_P: 14_FPGA_banks_7A_8A (IC29.K20), 18_DDR3_TOP (IC34.C7)
DDR3_TOP_ODT: 14_FPGA_banks_7A_8A (IC29.B13), 18_DDR3_TOP (IC33.K1 IC34.K1 R197.2)
DDR3_TOP_RASn: 14_FPGA_banks_7A_8A (IC29.B8), 18_DDR3_TOP (IC33.J3 IC34.J3 R192.7)
DDR3_TOP_RESETn: 14_FPGA_banks_7A_8A (IC29.B22), 18_DDR3_TOP (IC33.T2 IC34.T2 R197.3)
DDR3_TOP_WEn: 14_FPGA_banks_7A_8A (IC29.C7), 18_DDR3_TOP (IC33.L3 IC34.L3 R197.1)
EXT_GXB_CLK_N: 15_FPGA_misc_banks (R184.2), 23_PCIe (J30.17), 26_Clocks_2 (R415.1)
EXT_GXB_CLK_P: 15_FPGA_misc_banks (R183.2), 23_PCIe (J30.15), 26_Clocks_2 (R413.1)
EXT_GXB_RX6_N: 15_FPGA_misc_banks (R186.2), 23_PCIe (J30.5)
EXT_GXB_RX6_P: 15_FPGA_misc_banks (R185.2), 23_PCIe (J30.3)
EXT_GXB_RX7_N: 15_FPGA_misc_banks (R188.2), 23_PCIe (J30.6)
EXT_GXB_RX7_P: 15_FPGA_misc_banks (R187.2), 23_PCIe (J30.4)
EXT_GXB_TX6_N: 15_FPGA_misc_banks (C331.2), 23_PCIe (J30.11)
EXT_GXB_TX6_P: 15_FPGA_misc_banks (C330.2), 23_PCIe (J30.9)
EXT_GXB_TX7_N: 15_FPGA_misc_banks (C334.2), 23_PCIe (J30.12)
EXT_GXB_TX7_P: 15_FPGA_misc_banks (C333.2), 23_PCIe (J30.10)
FAN_CTRL: 13_FPGA_banks_5A_5B_6A (IC29.J22), 24_Peripherals (R344.1 VT16.G)
FPGA_ADC_RESET: 14_FPGA_banks_7A_8A (IC29.D6), 20_ADC (IC37.12 R221.1)
FPGA_CONF_DONE: 15_FPGA_misc_banks (IC29.L8 R175.2 VT13.G), 22_USB3_0_device (IC42.F4)
FPGA_LED1: 13_FPGA_banks_5A_5B_6A (IC29.G28), 24_Peripherals (R337.1)
FPGA_LED2: 13_FPGA_banks_5A_5B_6A (IC29.G27), 24_Peripherals (R340.1)
FPGA_LED3: 13_FPGA_banks_5A_5B_6A (IC29.J27), 24_Peripherals (R341.1)
FPGA_LED4: 13_FPGA_banks_5A_5B_6A (IC29.H24), 24_Peripherals (R343.1)
FPGA_LED5_G: 13_FPGA_banks_5A_5B_6A (IC29.W29), 24_Peripherals (R345.1)
FPGA_LED5_R: 13_FPGA_banks_5A_5B_6A (IC29.T30), 24_Peripherals (R346.1)
FPGA_NCONFIG: 15_FPGA_misc_banks (IC29.C5 R177.2), 22_USB3_0_device (IC42.G3)
FPGA_NSTATUS: 15_FPGA_misc_banks (IC29.K7 R174.2), 22_USB3_0_device (IC42.G2)
FPGA_SPI0_ADC_SS: 14_FPGA_banks_7A_8A (IC29.E26), 20_ADC (IC37.15 R219.1)
FPGA_SPI0_ADF_SS: 14_FPGA_banks_7A_8A (IC29.E25), 25_Clocks_1 (R405.1 R407.1)
FPGA_SPI0_DAC_SS: 14_FPGA_banks_7A_8A (IC29.G23), 25_Clocks_1 (R399.1 R400.2)
FPGA_SPI0_LMS1_SS: 04_LMS7002M_Digital (R16.2), 13_FPGA_banks_5A_5B_6A (IC29.V29)
FPGA_SPI0_LMS2_SS: 04_LMS7002M_Digital (R36.2), 13_FPGA_banks_5A_5B_6A (IC29.U29)
FPGA_SPI0_MISO_ADC: 14_FPGA_banks_7A_8A (IC29.L20), 20_ADC (IC37.64)
FPGA_SPI0_MISO_LMS1: 04_LMS7002M_Digital (R15.2), 13_FPGA_banks_5A_5B_6A (IC29.R30)
FPGA_SPI0_MISO_LMS2: 04_LMS7002M_Digital (R34.2), 13_FPGA_banks_5A_5B_6A (IC29.V30)
FPGA_SPI0_MOSI: 04_LMS7002M_Digital (R13.2 R33.2), 13_FPGA_banks_5A_5B_6A (IC29.R26), 20_ADC (IC37.14), 25_Clocks_1 (R403.1 R404.2)
FPGA_SPI0_SCLK: 04_LMS7002M_Digital (R12.2 R32.2), 13_FPGA_banks_5A_5B_6A (IC29.T25), 20_ADC (IC37.13), 25_Clocks_1 (R401.1 R402.2)
FPGA_SPI1_FLASH_SS_LS: 12_FPGA_banks_3A_3B_4A (IC29.AB13), 24_Peripherals (IC49.4)
FPGA_SPI1_MISO_LS: 12_FPGA_banks_3A_3B_4A (IC29.AB12), 24_Peripherals (IC49.3)
FPGA_SPI1_MOSI_LS: 12_FPGA_banks_3A_3B_4A (IC29.AG12), 24_Peripherals (IC49.2)
FPGA_SPI1_SCLK_LS: 12_FPGA_banks_3A_3B_4A (IC29.AF13), 24_Peripherals (IC49.1)
FPGA_SPI2_LMS1_RX1_I_MISO: 10_RSSI1 (IC18.8), 14_FPGA_banks_7A_8A (IC29.J7)
FPGA_SPI2_LMS1_RX1_Q_MISO: 10_RSSI1 (IC20.8), 14_FPGA_banks_7A_8A (IC29.A3)
FPGA_SPI2_LMS2_RX1_I_MISO: 11_RSSI2 (IC23.8), 14_FPGA_banks_7A_8A (IC29.H15)
FPGA_SPI2_LMS2_RX1_I_SCLK: 10_RSSI1 (IC21.8), 11_RSSI2 (IC23.9)
FPGA_SPI2_LMS2_RX1_Q_MISO: 11_RSSI2 (IC25.8), 14_FPGA_banks_7A_8A (IC29.G9)
FPGA_SPI2_LMS2_RX1_Q_SCLK: 10_RSSI1 (IC21.7), 11_RSSI2 (IC25.9)
FPGA_SPI2_LMS2_RX2_I_MISO: 11_RSSI2 (IC26.8), 14_FPGA_banks_7A_8A (IC29.C27)
FPGA_SPI2_LMS2_RX2_I_SCLK: 10_RSSI1 (IC21.5), 11_RSSI2 (IC26.9)
FPGA_SPI2_LMS2_RX2_Q_MISO: 11_RSSI2 (IC28.8), 14_FPGA_banks_7A_8A (IC29.F6)
FPGA_SPI2_LMS2_RX2_Q_SCLK: 10_RSSI1 (IC21.17), 11_RSSI2 (IC28.9)
FPGA_SPI2_LMS_RX_DET_SS: 10_RSSI1 (IC18.6 IC20.6), 11_RSSI2 (IC23.6 IC25.6 IC26.6 IC28.6), 12_FPGA_banks_3A_3B_4A (IC29.AJ17)
FPGA_SPI2_SCLK: 09_RF_Loopback (IC9.9), 10_RSSI1 (C249.2)
FPGA_SPI2_SCLK_LS: 09_RF_Loopback (IC9.4), 12_FPGA_banks_3A_3B_4A (IC29.AK15)
FPGA_SW0: 14_FPGA_banks_7A_8A (IC29.H7), 24_Peripherals (R334.2 SW2.8)
FPGA_SW1: 14_FPGA_banks_7A_8A (IC29.A2), 24_Peripherals (R333.2 SW2.7)
FPGA_SW2: 14_FPGA_banks_7A_8A (IC29.E6), 24_Peripherals (R332.2 SW2.6)
FPGA_SW3: 14_FPGA_banks_7A_8A (IC29.F8), 24_Peripherals (R331.2 SW2.5)
FX3_AS_SW: 15_FPGA_misc_banks (IC31.1 R178.1), 22_USB3_0_device (IC42.F3)
FX3_CTL0: 12_FPGA_banks_3A_3B_4A (IC29.AA9), 22_USB3_0_device (R293.2)
FX3_CTL1: 12_FPGA_banks_3A_3B_4A (IC29.AB8), 22_USB3_0_device (R295.2)
FX3_CTL2: 12_FPGA_banks_3A_3B_4A (IC29.AC9), 22_USB3_0_device (R295.4)
FX3_CTL3: 12_FPGA_banks_3A_3B_4A (IC29.AD9), 22_USB3_0_device (R295.6)
FX3_CTL4: 12_FPGA_banks_3A_3B_4A (IC29.AF8), 22_USB3_0_device (R295.8)
FX3_CTL5: 12_FPGA_banks_3A_3B_4A (IC29.AF7), 22_USB3_0_device (R301.2)
FX3_CTL6: 12_FPGA_banks_3A_3B_4A (IC29.AG7), 22_USB3_0_device (R301.4)
FX3_CTL7: 12_FPGA_banks_3A_3B_4A (IC29.AF6), 22_USB3_0_device (R301.6)
FX3_CTL8: 12_FPGA_banks_3A_3B_4A (IC29.AG6), 22_USB3_0_device (R301.8)
FX3_CTL9: 12_FPGA_banks_3A_3B_4A (IC29.AH7), 22_USB3_0_device (R308.2)
FX3_CTL10: 12_FPGA_banks_3A_3B_4A (IC29.AH6), 22_USB3_0_device (R308.4)
FX3_CTL11: 12_FPGA_banks_3A_3B_4A (IC29.AH4), 22_USB3_0_device (R308.6)
FX3_CTL12: 12_FPGA_banks_3A_3B_4A (IC29.AH5), 22_USB3_0_device (R308.8)
FX3_DQ0: 12_FPGA_banks_3A_3B_4A (IC29.U12), 22_USB3_0_device (R284.2)
FX3_DQ1: 12_FPGA_banks_3A_3B_4A (IC29.U11), 22_USB3_0_device (R284.4)
FX3_DQ2: 12_FPGA_banks_3A_3B_4A (IC29.U8), 22_USB3_0_device (R284.6)
FX3_DQ3: 12_FPGA_banks_3A_3B_4A (IC29.U9), 22_USB3_0_device (R284.8)
FX3_DQ4: 12_FPGA_banks_3A_3B_4A (IC29.T11), 22_USB3_0_device (R285.2)
FX3_DQ5: 12_FPGA_banks_3A_3B_4A (IC29.R10), 22_USB3_0_device (R285.4)
FX3_DQ6: 12_FPGA_banks_3A_3B_4A (IC29.T10), 22_USB3_0_device (R285.6)
FX3_DQ7: 12_FPGA_banks_3A_3B_4A (IC29.T9), 22_USB3_0_device (R285.8)
FX3_DQ8: 12_FPGA_banks_3A_3B_4A (IC29.V11), 22_USB3_0_device (R289.2)
FX3_DQ9: 12_FPGA_banks_3A_3B_4A (IC29.V9), 22_USB3_0_device (R289.4)
FX3_DQ10: 12_FPGA_banks_3A_3B_4A (IC29.V10), 22_USB3_0_device (R289.6)
FX3_DQ11: 12_FPGA_banks_3A_3B_4A (IC29.W10), 22_USB3_0_device (R289.8)
FX3_DQ12: 12_FPGA_banks_3A_3B_4A (IC29.Y10), 22_USB3_0_device (R291.2)
FX3_DQ13: 12_FPGA_banks_3A_3B_4A (IC29.Y11), 22_USB3_0_device (R291.4)
FX3_DQ14: 12_FPGA_banks_3A_3B_4A (IC29.AA11), 22_USB3_0_device (R291.6)
FX3_DQ15: 12_FPGA_banks_3A_3B_4A (IC29.AA8), 22_USB3_0_device (R291.8)
FX3_FPGA_GPIO0: 12_FPGA_banks_3A_3B_4A (IC29.AA10), 22_USB3_0_device (IC42.E1)
FX3_FPGA_GPIO1: 12_FPGA_banks_3A_3B_4A (IC29.AB9), 22_USB3_0_device (IC42.E5)
FX3_FPGA_GPIO2: 12_FPGA_banks_3A_3B_4A (IC29.AG8), 22_USB3_0_device (IC42.E4)
FX3_FPGA_GPIO3: 12_FPGA_banks_3A_3B_4A (IC29.AK3), 22_USB3_0_device (IC42.D1 R297.2)
FX3_FPGA_GPIO4: 12_FPGA_banks_3A_3B_4A (IC29.AJ4), 22_USB3_0_device (IC42.D2 R299.2)
FX3_FPGA_GPIO5: 12_FPGA_banks_3A_3B_4A (IC29.AJ3), 22_USB3_0_device (IC42.D3 R300.2)
FX3_PCLK: 12_FPGA_banks_3A_3B_4A (IC29.AB16), 22_USB3_0_device (R292.2)
FX3_SPI_AS_SS: 15_FPGA_misc_banks (IC31.14), 22_USB3_0_device (IC42.F2)
FX3_SPI_FPGA_SS: 12_FPGA_banks_3A_3B_4A (IC29.AG22), 22_USB3_0_device (IC42.F5)
FX3_SPI_MISO: 13_FPGA_banks_5A_5B_6A (IC29.M21), 15_FPGA_misc_banks (IC31.5), 22_USB3_0_device (IC42.C2 IC43.2 R303.1)
FX3_SPI_MOSI: 13_FPGA_banks_5A_5B_6A (IC29.N20), 15_FPGA_misc_banks (IC31.2), 22_USB3_0_device (IC42.D5 IC43.5)
FX3_SPI_SCLK: 13_FPGA_banks_5A_5B_6A (IC29.P20), 15_FPGA_misc_banks (IC31.11), 22_USB3_0_device (IC42.D4 IC43.6 R310.2)
GNSS _FIX: 13_FPGA_banks_5A_5B_6A (IC29.R23), 24_Peripherals (C773.1 R355.2)
GNSS _TX: 13_FPGA_banks_5A_5B_6A (IC29.K22), 24_Peripherals (C769.1 R353.2)
GNSS_RX: 13_FPGA_banks_5A_5B_6A (IC29.K25), 24_Peripherals (C768.1 R347.2)
GNSS_TPULSE: 13_FPGA_banks_5A_5B_6A (IC29.T23), 24_Peripherals (R358.2)
I2C_SCL: 22_USB3_0_device (R287.1), 24_Peripherals (5 pins), 26_Clocks_2 (IC57.4)
I2C_SCL_LS: 12_FPGA_banks_3A_3B_4A (IC29.AG23), 24_Peripherals (R349.2 VT17.S)
I2C_SDA: 22_USB3_0_device (R288.1), 24_Peripherals (5 pins), 26_Clocks_2 (IC57.5)
I2C_SDA_LS: 12_FPGA_banks_3A_3B_4A (IC29.AH22), 24_Peripherals (R348.2 VT18.S)
LM75_OS: 14_FPGA_banks_7A_8A (IC29.A28), 24_Peripherals (IC47.3 R352.1)
LMS1_CORE_LDO_EN: 04_LMS7002M_Digital (IC1.U33 R9.2), 13_FPGA_banks_5A_5B_6A (IC29.Y25)
LMS1_DIQ1_D0: 04_LMS7002M_Digital (IC1.AG31), 13_FPGA_banks_5A_5B_6A (IC29.T28)
LMS1_DIQ1_D1: 04_LMS7002M_Digital (IC1.AF30), 13_FPGA_banks_5A_5B_6A (IC29.Y23)
LMS1_DIQ1_D2: 04_LMS7002M_Digital (IC1.AF34), 13_FPGA_banks_5A_5B_6A (IC29.AB28)
LMS1_DIQ1_D3: 04_LMS7002M_Digital (IC1.AE31), 13_FPGA_banks_5A_5B_6A (IC29.T29)
LMS1_DIQ1_D4: 04_LMS7002M_Digital (IC1.AD30), 13_FPGA_banks_5A_5B_6A (IC29.AA23)
LMS1_DIQ1_D5: 04_LMS7002M_Digital (IC1.AC29), 13_FPGA_banks_5A_5B_6A (IC29.V22)
LMS1_DIQ1_D6: 04_LMS7002M_Digital (IC1.AE33), 13_FPGA_banks_5A_5B_6A (IC29.V24)
LMS1_DIQ1_D7: 04_LMS7002M_Digital (IC1.AD32), 13_FPGA_banks_5A_5B_6A (IC29.Y27)
LMS1_DIQ1_D8: 04_LMS7002M_Digital (IC1.AC31), 13_FPGA_banks_5A_5B_6A (IC29.AC24)
LMS1_DIQ1_D9: 04_LMS7002M_Digital (IC1.AC33), 13_FPGA_banks_5A_5B_6A (IC29.V25)
LMS1_DIQ1_D10: 04_LMS7002M_Digital (IC1.AB30), 13_FPGA_banks_5A_5B_6A (IC29.W22)
LMS1_DIQ1_D11: 04_LMS7002M_Digital (IC1.AB32), 13_FPGA_banks_5A_5B_6A (IC29.AA24)
LMS1_DIQ2_D0: 04_LMS7002M_Digital (IC1.H30), 13_FPGA_banks_5A_5B_6A (IC29.AC27)
LMS1_DIQ2_D1: 04_LMS7002M_Digital (IC1.J31), 13_FPGA_banks_5A_5B_6A (IC29.AB27)
LMS1_DIQ2_D2: 04_LMS7002M_Digital (IC1.K30), 13_FPGA_banks_5A_5B_6A (IC29.Y21)
LMS1_DIQ2_D3: 04_LMS7002M_Digital (IC1.K32), 13_FPGA_banks_5A_5B_6A (IC29.AA29)
LMS1_DIQ2_D4: 04_LMS7002M_Digital (IC1.L31), 13_FPGA_banks_5A_5B_6A (IC29.Y28)
LMS1_DIQ2_D5: 04_LMS7002M_Digital (IC1.K34), 13_FPGA_banks_5A_5B_6A (IC29.AC26)
LMS1_DIQ2_D6: 04_LMS7002M_Digital (IC1.M30), 13_FPGA_banks_5A_5B_6A (IC29.W27)
LMS1_DIQ2_D7: 04_LMS7002M_Digital (IC1.M32), 13_FPGA_banks_5A_5B_6A (IC29.AA25)
LMS1_DIQ2_D8: 04_LMS7002M_Digital (IC1.N31), 13_FPGA_banks_5A_5B_6A (IC29.V26)
LMS1_DIQ2_D9: 04_LMS7002M_Digital (IC1.N33), 13_FPGA_banks_5A_5B_6A (IC29.AH29)
LMS1_DIQ2_D10: 04_LMS7002M_Digital (IC1.P30), 13_FPGA_banks_5A_5B_6A (IC29.V27)
LMS1_DIQ2_D11: 04_LMS7002M_Digital (IC1.P32), 13_FPGA_banks_5A_5B_6A (IC29.W28)
LMS1_ENABLE_IQSEL1: 04_LMS7002M_Digital (IC1.Y32), 13_FPGA_banks_5A_5B_6A (IC29.U28)
LMS1_ENABLE_IQSEL2: 04_LMS7002M_Digital (IC1.R33), 13_FPGA_banks_5A_5B_6A (IC29.AA26)
LMS1_FCLK1: 04_LMS7002M_Digital (IC1.AA33), 13_FPGA_banks_5A_5B_6A (IC29.Y30)
LMS1_FCLK2: 04_LMS7002M_Digital (IC1.R29), 13_FPGA_banks_5A_5B_6A (IC29.Y22)
LMS1_I2C_SCL: 04_LMS7002M_Digital (IC1.C27), 07_LMS7002M_1_Power (IC3.6 IC4.6 R46.2)
LMS1_I2C_SDA: 04_LMS7002M_Digital (IC1.D26), 07_LMS7002M_1_Power (IC3.5 IC4.5 R44.2)
LMS1_LOOPBACK_RX1H: 05_LMS7002M_1_RF (C26.1), 09_RF_Loopback (IC12.5)
LMS1_LOOPBACK_RX2H: 05_LMS7002M_1_RF (C25.1), 09_RF_Loopback (IC16.5)
LMS1_LOOPBACK_TX12: 05_LMS7002M_1_RF (C21.1), 09_RF_Loopback (IC10.5)
LMS1_LOOPBACK_TX22: 05_LMS7002M_1_RF (C22.1), 09_RF_Loopback (IC14.5)
LMS1_MCLK1: 04_LMS7002M_Digital (IC1.AB34), 13_FPGA_banks_5A_5B_6A (IC29.U22)
LMS1_MCLK2: 04_LMS7002M_Digital (IC1.P34), 13_FPGA_banks_5A_5B_6A (IC29.U21)
LMS1_RESET: 04_LMS7002M_Digital (IC1.E27 R5.2), 13_FPGA_banks_5A_5B_6A (IC29.L21)
LMS1_RX1_BB_I_N: 04_LMS7002M_Digital (IC1.AB2 R3.1), 10_RSSI1 (R95.2), 20_ADC (R210.2)
LMS1_RX1_BB_I_P: 04_LMS7002M_Digital (IC1.Y6 R1.1), 10_RSSI1 (R94.2), 20_ADC (R214.2)
LMS1_RX1_BB_Q_N: 04_LMS7002M_Digital (IC1.AA5 R7.1), 10_RSSI1 (R97.2), 20_ADC (R225.2)
LMS1_RX1_BB_Q_P: 04_LMS7002M_Digital (IC1.AB4 R4.1), 10_RSSI1 (R96.2), 20_ADC (R229.2)
LMS1_RXEN: 04_LMS7002M_Digital (IC1.V34 R6.1), 13_FPGA_banks_5A_5B_6A (IC29.Y26)
LMS1_RxPLL_CLK: 04_LMS7002M_Digital (IC1.AM24), 25_Clocks_1 (C792.2 R369.1)
LMS1_TX1_BB_I_N: 04_LMS7002M_Digital (IC1.R5), 21_DAC (R271.1)
LMS1_TX1_BB_I_P: 04_LMS7002M_Digital (IC1.T4), 21_DAC (R268.1)
LMS1_TX1_BB_Q_N: 04_LMS7002M_Digital (IC1.P2), 21_DAC (R279.1)
LMS1_TX1_BB_Q_P: 04_LMS7002M_Digital (IC1.R3), 21_DAC (R275.1)
LMS1_TX2_BB_I_N: 04_LMS7002M_Digital (IC1.T6), 21_DAC (R274.1)
LMS1_TX2_BB_I_P: 04_LMS7002M_Digital (IC1.V2), 21_DAC (R270.1)
LMS1_TX2_BB_Q_N: 04_LMS7002M_Digital (IC1.U1), 21_DAC (R282.1)
LMS1_TX2_BB_Q_P: 04_LMS7002M_Digital (IC1.U3), 21_DAC (R278.1)
LMS1_TXEN: 04_LMS7002M_Digital (IC1.U29 R8.1), 13_FPGA_banks_5A_5B_6A (IC29.V21)
LMS1_TXNRX1: 04_LMS7002M_Digital (IC1.V32 R2.1), 13_FPGA_banks_5A_5B_6A (IC29.U27)
LMS1_TXNRX2: 04_LMS7002M_Digital (IC1.U31 R18.1), 13_FPGA_banks_5A_5B_6A (IC29.U26)
LMS1_TxPLL_CLK: 04_LMS7002M_Digital (IC1.E5), 25_Clocks_1 (C791.2 R367.1)
LMS2_CORE_LDO_EN: 04_LMS7002M_Digital (IC2.U33 R28.2), 13_FPGA_banks_5A_5B_6A (IC29.AD23)
LMS2_DIQ1_D0: 04_LMS7002M_Digital (IC2.AG31), 13_FPGA_banks_5A_5B_6A (IC29.AD25)
LMS2_DIQ1_D1: 04_LMS7002M_Digital (IC2.AF30), 13_FPGA_banks_5A_5B_6A (IC29.AD29)
LMS2_DIQ1_D2: 04_LMS7002M_Digital (IC2.AF34), 13_FPGA_banks_5A_5B_6A (IC29.AH27)
LMS2_DIQ1_D3: 04_LMS7002M_Digital (IC2.AE31), 13_FPGA_banks_5A_5B_6A (IC29.AE30)
LMS2_DIQ1_D4: 04_LMS7002M_Digital (IC2.AD30), 13_FPGA_banks_5A_5B_6A (IC29.AE28)
LMS2_DIQ1_D5: 04_LMS7002M_Digital (IC2.AC29), 13_FPGA_banks_5A_5B_6A (IC29.AD30)
LMS2_DIQ1_D6: 04_LMS7002M_Digital (IC2.AE33), 13_FPGA_banks_5A_5B_6A (IC29.AJ28)
LMS2_DIQ1_D7: 04_LMS7002M_Digital (IC2.AD32), 13_FPGA_banks_5A_5B_6A (IC29.AF26)
LMS2_DIQ1_D8: 04_LMS7002M_Digital (IC2.AC31), 13_FPGA_banks_5A_5B_6A (IC29.AE27)
LMS2_DIQ1_D9: 04_LMS7002M_Digital (IC2.AC33), 13_FPGA_banks_5A_5B_6A (IC29.AJ29)
LMS2_DIQ1_D10: 04_LMS7002M_Digital (IC2.AB30), 13_FPGA_banks_5A_5B_6A (IC29.AD28)
LMS2_DIQ1_D11: 04_LMS7002M_Digital (IC2.AB32), 13_FPGA_banks_5A_5B_6A (IC29.AF30)
LMS2_DIQ2_D0: 04_LMS7002M_Digital (IC2.H30), 13_FPGA_banks_5A_5B_6A (IC29.AA28)
LMS2_DIQ2_D1: 04_LMS7002M_Digital (IC2.J31), 13_FPGA_banks_5A_5B_6A (IC29.AJ30)
LMS2_DIQ2_D2: 04_LMS7002M_Digital (IC2.K30), 13_FPGA_banks_5A_5B_6A (IC29.AB29)
LMS2_DIQ2_D3: 04_LMS7002M_Digital (IC2.K32), 13_FPGA_banks_5A_5B_6A (IC29.AD24)
LMS2_DIQ2_D4: 04_LMS7002M_Digital (IC2.L31), 13_FPGA_banks_5A_5B_6A (IC29.AG28)
LMS2_DIQ2_D5: 04_LMS7002M_Digital (IC2.K34), 13_FPGA_banks_5A_5B_6A (IC29.AG27)
LMS2_DIQ2_D6: 04_LMS7002M_Digital (IC2.M30), 13_FPGA_banks_5A_5B_6A (IC29.AB26)
LMS2_DIQ2_D7: 04_LMS7002M_Digital (IC2.M32), 13_FPGA_banks_5A_5B_6A (IC29.AF24)
LMS2_DIQ2_D8: 04_LMS7002M_Digital (IC2.N31), 13_FPGA_banks_5A_5B_6A (IC29.AH30)
LMS2_DIQ2_D9: 04_LMS7002M_Digital (IC2.N33), 13_FPGA_banks_5A_5B_6A (IC29.AE23)
LMS2_DIQ2_D10: 04_LMS7002M_Digital (IC2.P30), 13_FPGA_banks_5A_5B_6A (IC29.AG29)
LMS2_DIQ2_D11: 04_LMS7002M_Digital (IC2.P32), 13_FPGA_banks_5A_5B_6A (IC29.AE26)
LMS2_ENABLE_IQSEL1: 04_LMS7002M_Digital (IC2.Y32), 13_FPGA_banks_5A_5B_6A (IC29.AF29)
LMS2_ENABLE_IQSEL2: 04_LMS7002M_Digital (IC2.R33), 13_FPGA_banks_5A_5B_6A (IC29.AF25)
LMS2_FCLK1: 04_LMS7002M_Digital (IC2.AA33), 13_FPGA_banks_5A_5B_6A (IC29.W30)
LMS2_FCLK2: 04_LMS7002M_Digital (IC2.R29), 13_FPGA_banks_5A_5B_6A (IC29.AC29)
LMS2_I2C_SCL: 04_LMS7002M_Digital (IC2.C27), 08_LMS7002M_2_Power (IC5.6 IC6.6 R62.2)
LMS2_I2C_SDA: 04_LMS7002M_Digital (IC2.D26), 08_LMS7002M_2_Power (IC5.5 IC6.5 R61.2)
LMS2_LOOPBACK_RX1H: 06_LMS7002M_2_RF (C52.1), 09_RF_Loopback (IC13.5)
LMS2_LOOPBACK_RX2H: 06_LMS7002M_2_RF (C51.1), 09_RF_Loopback (IC17.5)
LMS2_LOOPBACK_TX12: 06_LMS7002M_2_RF (C48.1), 09_RF_Loopback (IC11.5)
LMS2_LOOPBACK_TX22: 06_LMS7002M_2_RF (C47.1), 09_RF_Loopback (IC15.5)
LMS2_MCLK1: 04_LMS7002M_Digital (IC2.AB34), 13_FPGA_banks_5A_5B_6A (IC29.T24)
LMS2_MCLK2: 04_LMS7002M_Digital (IC2.P34), 13_FPGA_banks_5A_5B_6A (IC29.U23)
LMS2_RESET: 04_LMS7002M_Digital (IC2.E27 R25.2), 13_FPGA_banks_5A_5B_6A (IC29.AA30)
LMS2_RX1_BB_I_N: 04_LMS7002M_Digital (IC2.AB2 R21.1), 11_RSSI2 (R120.2)
LMS2_RX1_BB_I_P: 04_LMS7002M_Digital (IC2.Y6 R20.1), 11_RSSI2 (R119.2)
LMS2_RX1_BB_Q_N: 04_LMS7002M_Digital (IC2.AA5 R24.1), 11_RSSI2 (R122.2)
LMS2_RX1_BB_Q_P: 04_LMS7002M_Digital (IC2.AB4 R23.1), 11_RSSI2 (R121.2)
LMS2_RX2_BB_I_N: 04_LMS7002M_Digital (IC2.AC3 R30.1), 11_RSSI2 (R140.2)
LMS2_RX2_BB_I_P: 04_LMS7002M_Digital (IC2.AD2 R29.1), 11_RSSI2 (R139.2)
LMS2_RX2_BB_Q_N: 04_LMS7002M_Digital (IC2.AB6 R35.1), 11_RSSI2 (R142.2)
LMS2_RX2_BB_Q_P: 04_LMS7002M_Digital (IC2.AC5 R31.1), 11_RSSI2 (R141.2)
LMS2_RXEN: 04_LMS7002M_Digital (IC2.V34 R27.1), 13_FPGA_banks_5A_5B_6A (IC29.AE25)
LMS2_RxPLL_CLK: 04_LMS7002M_Digital (IC2.AM24), 25_Clocks_1 (C794.2 R373.1)
LMS2_TX1_BB_I_N: 04_LMS7002M_Digital (IC2.R5), 21_DAC (R273.1)
LMS2_TX1_BB_I_P: 04_LMS7002M_Digital (IC2.T4), 21_DAC (R269.1)
LMS2_TX1_BB_Q_N: 04_LMS7002M_Digital (IC2.P2), 21_DAC (R281.1)
LMS2_TX1_BB_Q_P: 04_LMS7002M_Digital (IC2.R3), 21_DAC (R277.1)
LMS2_TX2_BB_I_N: 04_LMS7002M_Digital (IC2.T6), 21_DAC (R276.1)
LMS2_TX2_BB_I_P: 04_LMS7002M_Digital (IC2.V2), 21_DAC (R272.1)
LMS2_TX2_BB_Q_N: 04_LMS7002M_Digital (IC2.U1), 21_DAC (R283.1)
LMS2_TX2_BB_Q_P: 04_LMS7002M_Digital (IC2.U3), 21_DAC (R280.1)
LMS2_TXEN: 04_LMS7002M_Digital (IC2.U29 R26.1), 13_FPGA_banks_5A_5B_6A (IC29.AD27)
LMS2_TXNRX1: 04_LMS7002M_Digital (IC2.V32 R22.1), 13_FPGA_banks_5A_5B_6A (IC29.AF28)
LMS2_TXNRX2: 04_LMS7002M_Digital (IC2.U31 R37.1), 13_FPGA_banks_5A_5B_6A (IC29.AC30)
LMS2_TxPLL_CLK: 04_LMS7002M_Digital (IC2.E5), 25_Clocks_1 (C793.2 R370.1)
PCIE_HSI0_N: 15_FPGA_misc_banks (C320.2), 23_PCIe (P1.A17)
PCIE_HSI0_P: 15_FPGA_misc_banks (C319.2), 23_PCIe (P1.A16)
PCIE_HSI1_N: 15_FPGA_misc_banks (C322.2), 23_PCIe (P1.A22)
PCIE_HSI1_P: 15_FPGA_misc_banks (C321.2), 23_PCIe (P1.A21)
PCIE_HSI2_N: 15_FPGA_misc_banks (C324.2), 23_PCIe (P1.A26)
PCIE_HSI2_P: 15_FPGA_misc_banks (C323.2), 23_PCIe (P1.A25)
PCIE_HSI3_N: 15_FPGA_misc_banks (C329.2), 23_PCIe (P1.A30)
PCIE_HSI3_P: 15_FPGA_misc_banks (C327.2), 23_PCIe (P1.A29)
PCIE_HSO0_N: 15_FPGA_misc_banks (IC29.AG1), 23_PCIe (P1.B15)
PCIE_HSO0_P: 15_FPGA_misc_banks (IC29.AG2), 23_PCIe (P1.B14)
PCIE_HSO1_N: 15_FPGA_misc_banks (IC29.AE1), 23_PCIe (P1.B20)
PCIE_HSO1_P: 15_FPGA_misc_banks (IC29.AE2), 23_PCIe (P1.B19)
PCIE_HSO2_N: 15_FPGA_misc_banks (IC29.AC1), 23_PCIe (P1.B24)
PCIE_HSO2_P: 15_FPGA_misc_banks (IC29.AC2), 23_PCIe (P1.B23)
PCIE_HSO3_N: 15_FPGA_misc_banks (IC29.AA1), 23_PCIe (P1.B28)
PCIE_HSO3_P: 15_FPGA_misc_banks (IC29.AA2), 23_PCIe (P1.B27)
PCIE_PERSTn: 13_FPGA_banks_5A_5B_6A (IC29.W24), 23_PCIe (P1.A11)
PCIE_REFCLK_N: 15_FPGA_misc_banks (IC29.W7), 23_PCIe (P1.A14)
PCIE_REFCLK_P: 15_FPGA_misc_banks (IC29.W8), 23_PCIe (P1.A13)
PCIE_SMCLK_LS: 12_FPGA_banks_3A_3B_4A (IC29.W12), 23_PCIe (R319.2 VT14.S)
PCIE_SMDAT_LS: 12_FPGA_banks_3A_3B_4A (IC29.V12), 23_PCIe (R318.2 VT15.S)
PCIE_WAKEn: 13_FPGA_banks_5A_5B_6A (IC29.G26), 23_PCIe (R324.1)
PD_ADC_DRV: 13_FPGA_banks_5A_5B_6A (IC29.K21), 20_ADC (IC38.14 IC38.20 R222.1)
PMOD_A_PIN1_LS: 12_FPGA_banks_3A_3B_4A (IC29.AD12), 24_Peripherals (IC44.19)
PMOD_A_PIN2_LS: 12_FPGA_banks_3A_3B_4A (IC29.AE10), 24_Peripherals (IC44.18)
PMOD_A_PIN3_LS: 12_FPGA_banks_3A_3B_4A (IC29.AF10), 24_Peripherals (IC44.17)
PMOD_A_PIN4_LS: 12_FPGA_banks_3A_3B_4A (IC29.AD13), 24_Peripherals (IC44.16)
PMOD_A_PIN7_LS: 12_FPGA_banks_3A_3B_4A (IC29.AE12), 24_Peripherals (IC44.15)
PMOD_A_PIN8_LS: 12_FPGA_banks_3A_3B_4A (IC29.AE13), 24_Peripherals (IC44.14)
PMOD_A_PIN9_LS: 12_FPGA_banks_3A_3B_4A (IC29.AJ2), 24_Peripherals (IC44.13)
PMOD_A_PIN10_LS: 12_FPGA_banks_3A_3B_4A (IC29.AJ1), 24_Peripherals (IC44.12)
PMOD_B_PIN1_LS: 12_FPGA_banks_3A_3B_4A (IC29.AF20), 24_Peripherals (IC45.19)
PMOD_B_PIN2_LS: 12_FPGA_banks_3A_3B_4A (IC29.AG21), 24_Peripherals (IC45.18)
PMOD_B_PIN3_LS: 12_FPGA_banks_3A_3B_4A (IC29.AF21), 24_Peripherals (IC45.17)
PMOD_B_PIN4_LS: 12_FPGA_banks_3A_3B_4A (IC29.AD20), 24_Peripherals (IC45.16)
PMOD_B_PIN7_LS: 12_FPGA_banks_3A_3B_4A (IC29.AK27), 24_Peripherals (IC45.15)
PMOD_B_PIN8_LS: 12_FPGA_banks_3A_3B_4A (IC29.AE22), 24_Peripherals (IC45.14)
PMOD_B_PIN9_LS: 12_FPGA_banks_3A_3B_4A (IC29.AC21), 24_Peripherals (IC45.13)
PMOD_B_PIN10_LS: 12_FPGA_banks_3A_3B_4A (IC29.AH26), 24_Peripherals (IC45.12)
RF_SW_V1: 10_RSSI1 (IC22.17 R113.2), 14_FPGA_banks_7A_8A (IC29.J10)
RF_SW_V2: 10_RSSI1 (IC22.18 R112.2), 14_FPGA_banks_7A_8A (IC29.G22)
RF_SW_V3: 10_RSSI1 (IC22.19 R111.2), 14_FPGA_banks_7A_8A (IC29.K10)
RTC_32KHZ: 14_FPGA_banks_7A_8A (IC29.H17), 24_Peripherals (IC50.1 R363.1)
RTC_INT_SQW: 14_FPGA_banks_7A_8A (IC29.K15), 24_Peripherals (IC50.3 R362.1)
SI_CLK0: 13_FPGA_banks_5A_5B_6A (IC29.P22), 26_Clocks_2 (IC57.13)
SI_CLK1: 13_FPGA_banks_5A_5B_6A (IC29.P23), 26_Clocks_2 (IC57.12)
SI_CLK4: 25_Clocks_1 (R374.2), 26_Clocks_2 (IC57.19)
SI_CLK6: 12_FPGA_banks_3A_3B_4A (IC29.AB18), 26_Clocks_2 (IC57.16)
SI_CLK7: 12_FPGA_banks_3A_3B_4A (IC29.AC15), 26_Clocks_2 (IC57.15)
SI_CLKIN: 25_Clocks_1 (IC52.18), 26_Clocks_2 (R412.1)
SR_DIN_LS: 09_RF_Loopback (IC9.1), 12_FPGA_banks_3A_3B_4A (IC29.AJ5)
SR_LATCH_LS: 09_RF_Loopback (IC9.3), 14_FPGA_banks_7A_8A (IC29.B26)
SR_SCLK_LS: 09_RF_Loopback (IC9.2), 12_FPGA_banks_3A_3B_4A (IC29.AA13)